# EAGLE board F2CE_V3_Main (EAGLE 9.6.2), part 1 of 2
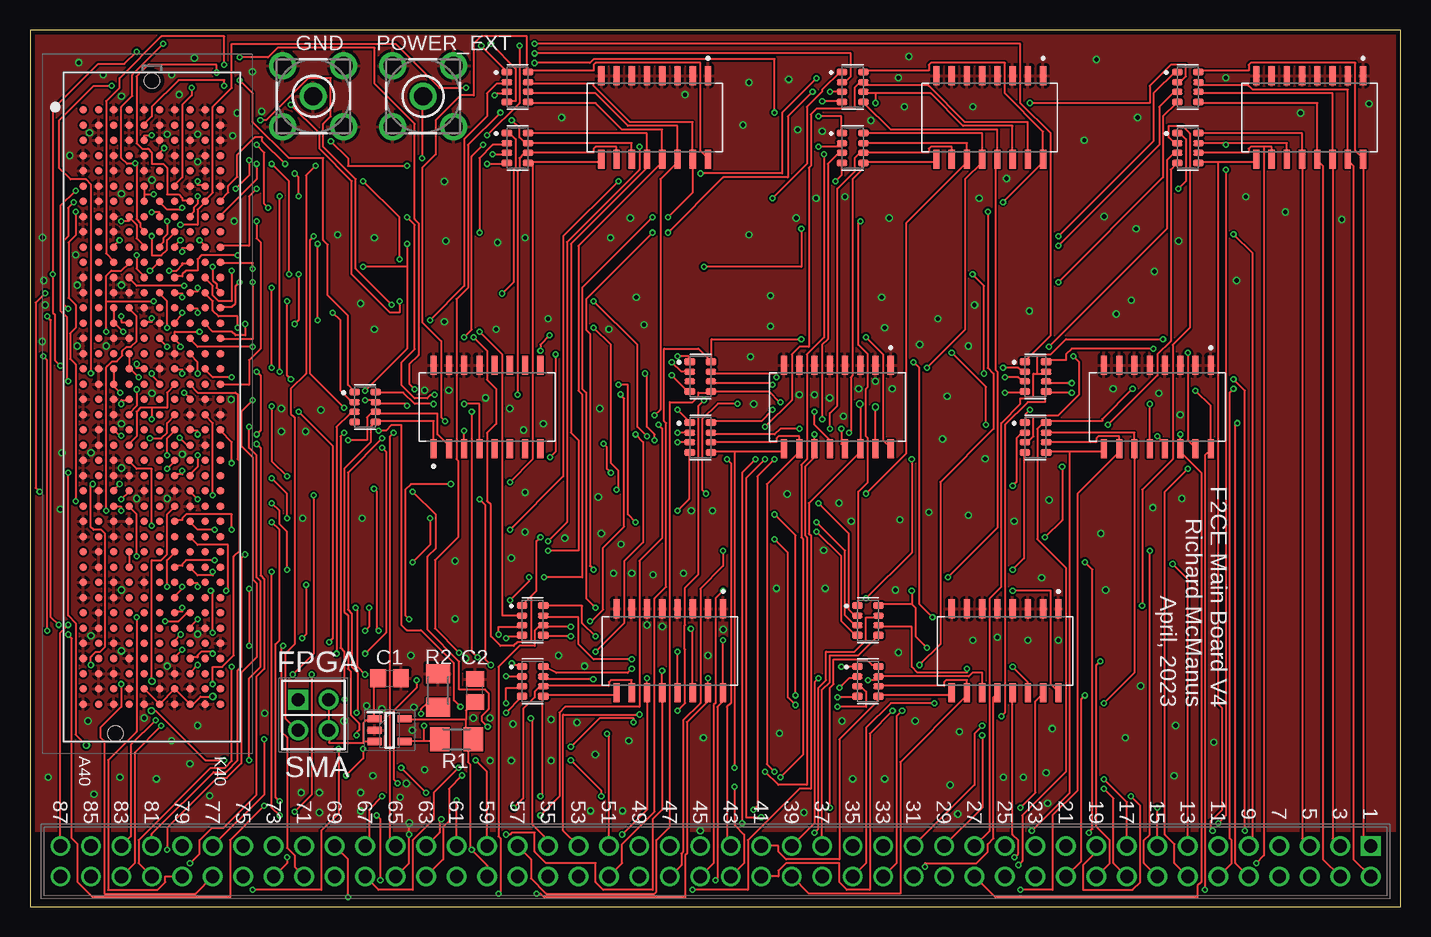
[diagram p4: board, top side]
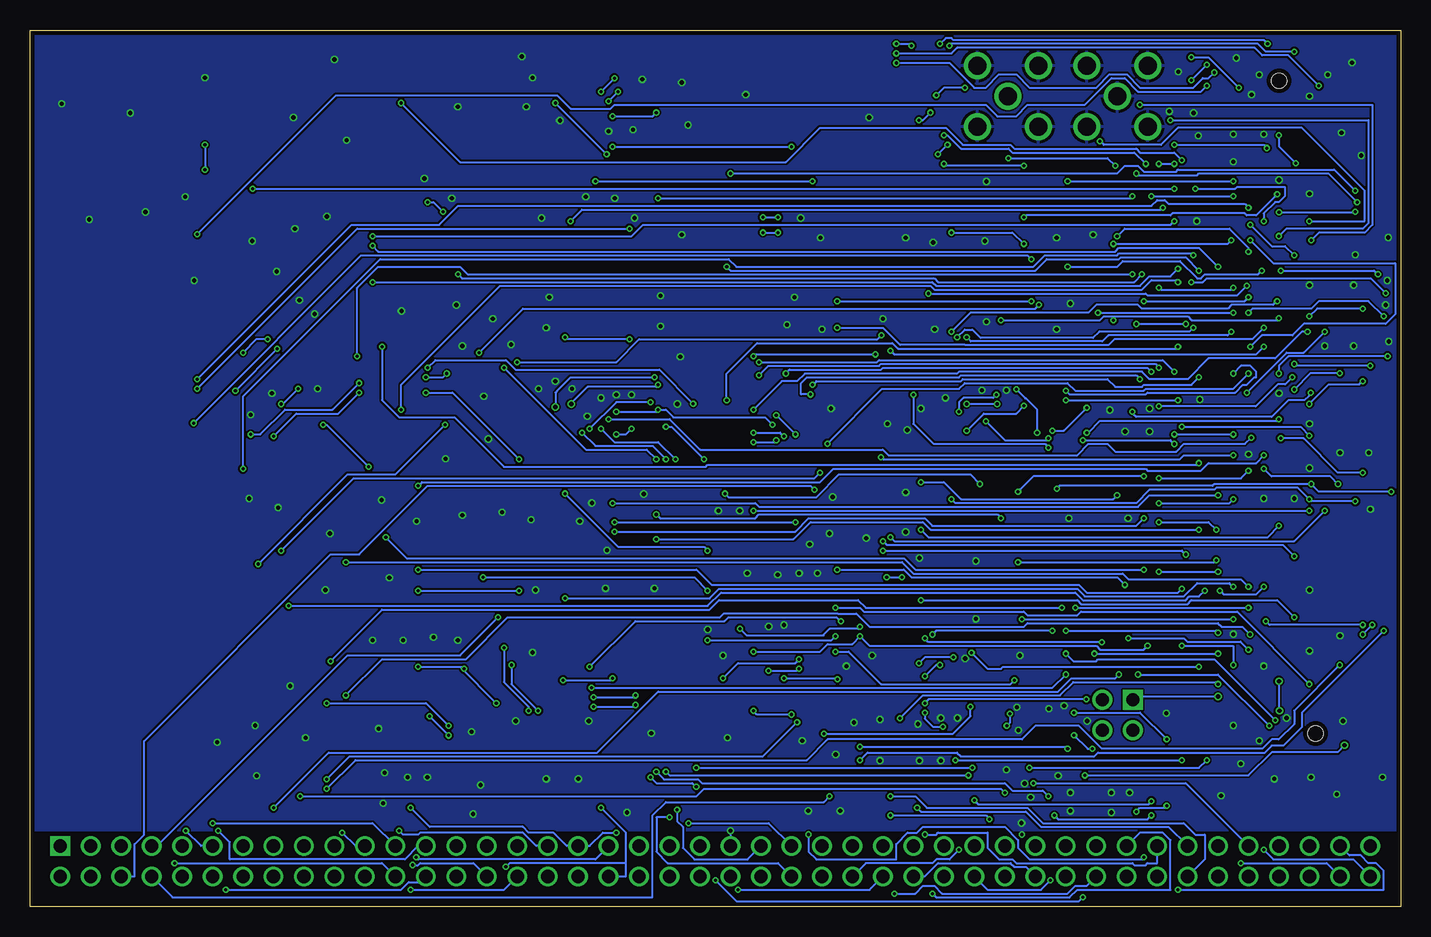
[diagram p5: board, bottom side, seen from below]

Size 114.28 x 73.08 mm. Coordinates in mm from the lower left corner, seen from the top.
Outline: 0,0 114.28,0 114.28,73.08 0,73.08 0,0
Copper layers (1*16): Top 0.035559375mm / dielectric 1.6mm / Bottom 0.035559375mm
Design rules "oshpark-2layer *": minimum track width 6mil, minimum drill 10mil, track to track 6mil, track to pad 6mil, pad to pad 8mil, via to via 6mil, smd to smd 6mil, copper to edge 15mil, drill to drill 6mil, minimum pad ring 5mil, minimum via ring 5mil, stop-mask expansion 2.5mil, vias tented up to drill 15mil, thermal gap 10mil

## Footprints (pad centres in the part's own frame; a part is rotated, then mirrored left to right if it is on the bottom)
RESCAXE80P320X160X70-8N = smd 0.9 x 0.61: 1 -0.885,1.24; 4 -0.885,-1.24; 5 0.885,-1.24; 8 0.885,1.24 | smd 0.9 x 0.53: 2 -0.885,0.4; 3 -0.885,-0.4; 6 0.885,-0.4; 7 0.885,0.4
SOIC127P762X240-16N = smd 1.59 x 0.6: 1 -3.495,4.445; 2 -3.495,3.175; 3 -3.495,1.905; 4 -3.495,0.635; 5 -3.495,-0.635; 6 -3.495,-1.905; 7 -3.495,-3.175; 8 -3.495,-4.445; 9 3.495,-4.445; 10 3.495,-3.175; 11 3.495,-1.905; 12 3.495,-0.635; 13 3.495,0.635; 14 3.495,1.905; 15 3.495,3.175; 16 3.495,4.445
C0805 = smd 1.3 x 1.5: 1 -0.95,0; 2 0.95,0
LTI-SASF54GT = drill 1.5 pad 2.2: 1 0,0; 2 -2.54,2.54; 3 2.54,2.54; 4 2.54,-2.54; 5 -2.54,-2.54
SOT95P280X100-5N = smd 1.15 x 0.6: 1 -1.25,0.95; 2 -1.25,0; 3 -1.25,-0.95; 4 1.25,-0.95; 5 1.25,0.95
88-PIN-HEADER = drill 1.1 pad 1.65 square: 1 0,109.22 | drill 1.1 pad 1.65: 2 2.54,109.22; 3 0,106.68; 4 2.54,106.68; 5 0,104.14; 6 2.54,104.14; 7 0,101.6; 8 2.54,101.6; 9 0,99.06; 10 2.54,99.06; 11 0,96.52; 12 2.54,96.52; 13 0,93.98; 14 2.54,93.98; 15 0,91.44; 16 2.54,91.44; 17 0,88.9; 18 2.54,88.9; 19 0,86.36; 20 2.54,86.36; 21 0,83.82; 22 2.54,83.82; 23 0,81.28; 24 2.54,81.28; 25 0,78.74; 26 2.54,78.74; 27 0,76.2; 28 2.54,76.2; 29 0,73.66; 30 2.54,73.66; 31 0,71.12; 32 2.54,71.12; 33 0,68.58; 34 2.54,68.58; 35 0,66.04; 36 2.54,66.04; 37 0,63.5; 38 2.54,63.5; 39 0,60.96; 40 2.54,60.96; 41 0,58.42; 42 2.54,58.42; 43 0,55.88; 44 2.54,55.88; 45 0,53.34; 46 2.54,53.34; 47 0,50.8; 48 2.54,50.8; 49 0,48.26; 50 2.54,48.26; 51 0,45.72; 52 2.54,45.72; 53 0,43.18; 54 2.54,43.18; 55 0,40.64; 56 2.54,40.64; 57 0,38.1; 58 2.54,38.1; 59 0,35.56; 60 2.54,35.56; 61 0,33.02; 62 2.54,33.02; 63 0,30.48; 64 2.54,30.48; 65 0,27.94; 66 2.54,27.94; 67 0,25.4; 68 2.54,25.4; 69 0,22.86; 70 2.54,22.86; 71 0,20.32; 72 2.54,20.32; 73 0,17.78; 74 2.54,17.78; 75 0,15.24; 76 2.54,15.24; 77 0,12.7; 78 2.54,12.7; 79 0,10.16; 80 2.54,10.16; 81 0,7.62; 82 2.54,7.62; 83 0,5.08; 84 2.54,5.08; 85 0,2.54; 86 2.54,2.54; 87 0,0; 88 2.54,0
ASP13460201 = smd 0.64 x 0.64: A1 24.765,5.715; A2 23.495,5.715; A3 22.225,5.715; A4 20.955,5.715; A5 19.685,5.715; A6 18.415,5.715; A7 17.145,5.715; A8 15.875,5.715; A9 14.605,5.715; A10 13.335,5.715; A11 12.065,5.715; A12 10.795,5.715; A13 9.525,5.715; A14 8.255,5.715; A15 6.985,5.715; A16 5.715,5.715; A17 4.445,5.715; A18 3.175,5.715; A19 1.905,5.715; A20 0.635,5.715; A21 -0.635,5.715; A22 -1.905,5.715; A23 -3.175,5.715; A24 -4.445,5.715; A25 -5.715,5.715; A26 -6.985,5.715; A27 -8.255,5.715; A28 -9.525,5.715; A29 -10.795,5.715; A30 -12.065,5.715; A31 -13.335,5.715; A32 -14.605,5.715; A33 -15.875,5.715; A34 -17.145,5.715; A35 -18.415,5.715; A36 -19.685,5.715; A37 -20.955,5.715; A38 -22.225,5.715; A39 -23.495,5.715; A40 -24.765,5.715; B1 24.765,4.445; B2 23.495,4.445; B3 22.225,4.445; B4 20.955,4.445; B5 19.685,4.445; B6 18.415,4.445; B7 17.145,4.445; B8 15.875,4.445; B9 14.605,4.445; B10 13.335,4.445; B11 12.065,4.445; B12 10.795,4.445; B13 9.525,4.445; B14 8.255,4.445; B15 6.985,4.445; B16 5.715,4.445; B17 4.445,4.445; B18 3.175,4.445; B19 1.905,4.445; B20 0.635,4.445; B21 -0.635,4.445; B22 -1.905,4.445; B23 -3.175,4.445; B24 -4.445,4.445; B25 -5.715,4.445; B26 -6.985,4.445; B27 -8.255,4.445; B28 -9.525,4.445; B29 -10.795,4.445; B30 -12.065,4.445; B31 -13.335,4.445; B32 -14.605,4.445; B33 -15.875,4.445; B34 -17.145,4.445; B35 -18.415,4.445; B36 -19.685,4.445; B37 -20.955,4.445; B38 -22.225,4.445; B39 -23.495,4.445; B40 -24.765,4.445; C1 24.765,3.175; C2 23.495,3.175; C3 22.225,3.175; C4 20.955,3.175; C5 19.685,3.175; C6 18.415,3.175; C7 17.145,3.175; C8 15.875,3.175; C9 14.605,3.175; C10 13.335,3.175; C11 12.065,3.175; C12 10.795,3.175; C13 9.525,3.175; C14 8.255,3.175; C15 6.985,3.175; C16 5.715,3.175; C17 4.445,3.175; C18 3.175,3.175; C19 1.905,3.175; C20 0.635,3.175; C21 -0.635,3.175; C22 -1.905,3.175; C23 -3.175,3.175; C24 -4.445,3.175; C25 -5.715,3.175; C26 -6.985,3.175; C27 -8.255,3.175; C28 -9.525,3.175; C29 -10.795,3.175; C30 -12.065,3.175; C31 -13.335,3.175; C32 -14.605,3.175; C33 -15.875,3.175; C34 -17.145,3.175; C35 -18.415,3.175; C36 -19.685,3.175; C37 -20.955,3.175; C38 -22.225,3.175; C39 -23.495,3.175; C40 -24.765,3.175; D1 24.765,1.905; D2 23.495,1.905; D3 22.225,1.905; D4 20.955,1.905; D5 19.685,1.905; D6 18.415,1.905; D7 17.145,1.905; D8 15.875,1.905; D9 14.605,1.905; D10 13.335,1.905; D11 12.065,1.905; D12 10.795,1.905; D13 9.525,1.905; D14 8.255,1.905; D15 6.985,1.905; D16 5.715,1.905; D17 4.445,1.905; D18 3.175,1.905; D19 1.905,1.905; D20 0.635,1.905; D21 -0.635,1.905; D22 -1.905,1.905; D23 -3.175,1.905; D24 -4.445,1.905; D25 -5.715,1.905; D26 -6.985,1.905; D27 -8.255,1.905; D28 -9.525,1.905; D29 -10.795,1.905; D30 -12.065,1.905; D31 -13.335,1.905; D32 -14.605,1.905; D33 -15.875,1.905; D34 -17.145,1.905; D35 -18.415,1.905; D36 -19.685,1.905; D37 -20.955,1.905; D38 -22.225,1.905; D39 -23.495,1.905; D40 -24.765,1.905; E1 24.765,0.635; E2 23.495,0.635; E3 22.225,0.635; E4 20.955,0.635; E5 19.685,0.635; E6 18.415,0.635; E7 17.145,0.635; E8 15.875,0.635; E9 14.605,0.635; E10 13.335,0.635; E11 12.065,0.635; E12 10.795,0.635; E13 9.525,0.635; E14 8.255,0.635; E15 6.985,0.635; E16 5.715,0.635; E17 4.445,0.635; E18 3.175,0.635; E19 1.905,0.635; E20 0.635,0.635; E21 -0.635,0.635; E22 -1.905,0.635; E23 -3.175,0.635; E24 -4.445,0.635; E25 -5.715,0.635; E26 -6.985,0.635; E27 -8.255,0.635; E28 -9.525,0.635; E29 -10.795,0.635; E30 -12.065,0.635; E31 -13.335,0.635; E32 -14.605,0.635; E33 -15.875,0.635; E34 -17.145,0.635; E35 -18.415,0.635; E36 -19.685,0.635; E37 -20.955,0.635; E38 -22.225,0.635; E39 -23.495,0.635; E40 -24.765,0.635; F1 24.765,-0.635; F2 23.495,-0.635; F3 22.225,-0.635; F4 20.955,-0.635; F5 19.685,-0.635; F6 18.415,-0.635; F7 17.145,-0.635; F8 15.875,-0.635; F9 14.605,-0.635; F10 13.335,-0.635; F11 12.065,-0.635; F12 10.795,-0.635; F13 9.525,-0.635; F14 8.255,-0.635; F15 6.985,-0.635; F16 5.715,-0.635; F17 4.445,-0.635; F18 3.175,-0.635; F19 1.905,-0.635; F20 0.635,-0.635; F21 -0.635,-0.635; F22 -1.905,-0.635; F23 -3.175,-0.635; F24 -4.445,-0.635; F25 -5.715,-0.635; F26 -6.985,-0.635; F27 -8.255,-0.635; F28 -9.525,-0.635; F29 -10.795,-0.635; F30 -12.065,-0.635; F31 -13.335,-0.635; F32 -14.605,-0.635; F33 -15.875,-0.635; F34 -17.145,-0.635; F35 -18.415,-0.635; F36 -19.685,-0.635; F37 -20.955,-0.635; F38 -22.225,-0.635; F39 -23.495,-0.635; F40 -24.765,-0.635; G1 24.765,-1.905; G2 23.495,-1.905; G3 22.225,-1.905; G4 20.955,-1.905; G5 19.685,-1.905; G6 18.415,-1.905; G7 17.145,-1.905; G8 15.875,-1.905; G9 14.605,-1.905; G10 13.335,-1.905; G11 12.065,-1.905; G12 10.795,-1.905; G13 9.525,-1.905; G14 8.255,-1.905; G15 6.985,-1.905; G16 5.715,-1.905; G17 4.445,-1.905; G18 3.175,-1.905; G19 1.905,-1.905; G20 0.635,-1.905; G21 -0.635,-1.905; G22 -1.905,-1.905; G23 -3.175,-1.905; G24 -4.445,-1.905; G25 -5.715,-1.905; G26 -6.985,-1.905; G27 -8.255,-1.905; G28 -9.525,-1.905; G29 -10.795,-1.905; G30 -12.065,-1.905; G31 -13.335,-1.905; G32 -14.605,-1.905; G33 -15.875,-1.905; G34 -17.145,-1.905; G35 -18.415,-1.905; G36 -19.685,-1.905; G37 -20.955,-1.905; G38 -22.225,-1.905; G39 -23.495,-1.905; G40 -24.765,-1.905; H1 24.765,-3.175; H2 23.495,-3.175; H3 22.225,-3.175; H4 20.955,-3.175; H5 19.685,-3.175; H6 18.415,-3.175; H7 17.145,-3.175; H8 15.875,-3.175; H9 14.605,-3.175; H10 13.335,-3.175; H11 12.065,-3.175; H12 10.795,-3.175; H13 9.525,-3.175; H14 8.255,-3.175; H15 6.985,-3.175; H16 5.715,-3.175; H17 4.445,-3.175; H18 3.175,-3.175; H19 1.905,-3.175; H20 0.635,-3.175; H21 -0.635,-3.175; H22 -1.905,-3.175; H23 -3.175,-3.175; H24 -4.445,-3.175; H25 -5.715,-3.175; H26 -6.985,-3.175; H27 -8.255,-3.175; H28 -9.525,-3.175; H29 -10.795,-3.175; H30 -12.065,-3.175; H31 -13.335,-3.175; H32 -14.605,-3.175; H33 -15.875,-3.175; H34 -17.145,-3.175; H35 -18.415,-3.175; H36 -19.685,-3.175; H37 -20.955,-3.175; H38 -22.225,-3.175; H39 -23.495,-3.175; H40 -24.765,-3.175; J1 24.765,-4.445; J2 23.495,-4.445; J3 22.225,-4.445; J4 20.955,-4.445; J5 19.685,-4.445; J6 18.415,-4.445; J7 17.145,-4.445; J8 15.875,-4.445; J9 14.605,-4.445; J10 13.335,-4.445; J11 12.065,-4.445; J12 10.795,-4.445; J13 9.525,-4.445; J14 8.255,-4.445; J15 6.985,-4.445; J16 5.715,-4.445; J17 4.445,-4.445; J18 3.175,-4.445; J19 1.905,-4.445; J20 0.635,-4.445; J21 -0.635,-4.445; J22 -1.905,-4.445; J23 -3.175,-4.445; J24 -4.445,-4.445; J25 -5.715,-4.445; J26 -6.985,-4.445; J27 -8.255,-4.445; J28 -9.525,-4.445; J29 -10.795,-4.445; J30 -12.065,-4.445; J31 -13.335,-4.445; J32 -14.605,-4.445; J33 -15.875,-4.445; J34 -17.145,-4.445; J35 -18.415,-4.445; J36 -19.685,-4.445; J37 -20.955,-4.445; J38 -22.225,-4.445; J39 -23.495,-4.445; J40 -24.765,-4.445; K1 24.765,-5.715; K2 23.495,-5.715; K3 22.225,-5.715; K4 20.955,-5.715; K5 19.685,-5.715; K6 18.415,-5.715; K7 17.145,-5.715; K8 15.875,-5.715; K9 14.605,-5.715; K10 13.335,-5.715; K11 12.065,-5.715; K12 10.795,-5.715; K13 9.525,-5.715; K14 8.255,-5.715; K15 6.985,-5.715; K16 5.715,-5.715; K17 4.445,-5.715; K18 3.175,-5.715; K19 1.905,-5.715; K20 0.635,-5.715; K21 -0.635,-5.715; K22 -1.905,-5.715; K23 -3.175,-5.715; K24 -4.445,-5.715; K25 -5.715,-5.715; K26 -6.985,-5.715; K27 -8.255,-5.715; K28 -9.525,-5.715; K29 -10.795,-5.715; K30 -12.065,-5.715; K31 -13.335,-5.715; K32 -14.605,-5.715; K33 -15.875,-5.715; K34 -17.145,-5.715; K35 -18.415,-5.715; K36 -19.685,-5.715; K37 -20.955,-5.715; K38 -22.225,-5.715; K39 -23.495,-5.715; K40 -24.765,-5.715 | hole 1.27: -27.19,3.046; 27.19,0
HDRV4W64P254_2X2_521X508X851P = drill 1.1 pad 1.65 square: 1 0,0 | drill 1.1 pad 1.65: 2 0,2.54; 3 2.54,0; 4 2.54,2.54
M1206 = smd 1.6 x 2: 1 -1.4,0; 2 1.4,0

## Placement (x,y rotation side)
4BITVD1:R1  YC164-FR-0760R4L  [RESCAXE80P320X160X70-8N]  27.94,41.66 0 top
4BITVD1:RN1  4816P-1-121LF  [SOIC127P762X240-16N]  38.1,41.66 90 top
8BITVD1:R1  YC164-FR-0760R4L  [RESCAXE80P320X160X70-8N]  96.52,68.33 0 top
8BITVD1:R2  YC164-FR-0760R4L  [RESCAXE80P320X160X70-8N]  96.52,63.25 0 top
8BITVD1:RN1  4816P-1-121LF  [SOIC127P762X240-16N]  106.68,65.79 270 top
8BITVD2:R1  YC164-FR-0760R4L  [RESCAXE80P320X160X70-8N]  83.82,44.2 0 top
8BITVD2:R2  YC164-FR-0760R4L  [RESCAXE80P320X160X70-8N]  83.82,39.12 0 top
8BITVD2:RN1  4816P-1-121LF  [SOIC127P762X240-16N]  93.98,41.66 270 top
8BITVD3:R1  YC164-FR-0760R4L  [RESCAXE80P320X160X70-8N]  69.85,23.88 0 top
8BITVD3:R2  YC164-FR-0760R4L  [RESCAXE80P320X160X70-8N]  69.85,18.8 0 top
8BITVD3:RN1  4816P-1-121LF  [SOIC127P762X240-16N]  81.28,21.34 270 top
8BITVD4:R1  YC164-FR-0760R4L  [RESCAXE80P320X160X70-8N]  68.58,68.33 0 top
8BITVD4:R2  YC164-FR-0760R4L  [RESCAXE80P320X160X70-8N]  68.58,63.25 0 top
8BITVD4:RN1  4816P-1-121LF  [SOIC127P762X240-16N]  80.01,65.79 270 top
8BITVD5:R1  YC164-FR-0760R4L  [RESCAXE80P320X160X70-8N]  55.88,44.2 0 top
8BITVD5:R2  YC164-FR-0760R4L  [RESCAXE80P320X160X70-8N]  55.88,39.12 0 top
8BITVD5:RN1  4816P-1-121LF  [SOIC127P762X240-16N]  67.31,41.66 270 top
8BITVD6:R1  YC164-FR-0760R4L  [RESCAXE80P320X160X70-8N]  41.91,23.88 0 top
8BITVD6:R2  YC164-FR-0760R4L  [RESCAXE80P320X160X70-8N]  41.91,18.8 0 top
8BITVD6:RN1  4816P-1-121LF  [SOIC127P762X240-16N]  53.34,21.34 270 top
8BITVD7:R1  YC164-FR-0760R4L  [RESCAXE80P320X160X70-8N]  40.64,68.33 0 top
8BITVD7:R2  YC164-FR-0760R4L  [RESCAXE80P320X160X70-8N]  40.64,63.25 0 top
8BITVD7:RN1  4816P-1-121LF  [SOIC127P762X240-16N]  52.07,65.79 270 top
C1  1 uF  [C0805]  29.97,19.05 0 top
C2  1 uF  [C0805]  37.08,18.03 90 top
GND  LTI-SASF54GT  [LTI-SASF54GT]  23.62,67.56 0 top
IC1  ADP171AUJZ-R7  [SOT95P280X100-5N]  29.97,14.73 0 top
J1  88-PIN-HEADER  [88-PIN-HEADER]  2.54,5.08 270 top
J2  ASP-134602-01  [ASP13460201]  10.16,41.66 90 top
J3  70287-1098  [HDRV4W64P254_2X2_521X508X851P]  22.35,17.27 270 top
POWER_EXT  LTI-SASF54GT  [LTI-SASF54GT]  32.77,67.56 0 top
R1  510  [M1206]  35.56,13.97 180 top
R2  360  [M1206]  34.04,18.03 270 top

## Tracks (layer width: path | path; a pad name or v marks a point on that pad's centre or on a via)
4BITVD1:OUT3  (via drill 0.25)
  Top 0.152: v33.66,41.91 32.07,41.91 31.11,42.86 28.89,42.86 4BITVD1:R1.8 | v36.2,41.91 37.47,41.91 4BITVD1:RN1.4
  Bottom 0.152: v36.2,41.91 v33.66,41.91
8BITVD5:OUT1  (via drill 0.25, 0.35)
  Top 0.152: v62.23,44.13 62.23,44.45 56.83,44.45 8BITVD5:R1.7 | 8BITVD5:RN1.15 v70.48,41.66
  Bottom 0.152: v62.23,44.13 69.22,44.13 70.33,43.02 70.48,42.86 v70.48,41.66
C10  (via drill 0.25)
  Top 0.152: v7.46,55.56 6.99,55.09 J2.C10 | v21.75,66.83 24.13,64.45 24.13,63.18 26.83,60.48 26.83,52.7 30,49.53 30.8,49.53 v30.8,50.48 | v46.99,50.48 50.64,46.83 50.64,40.01 v51.44,39.21 | v53.98,39.53 54.93,39.53 8BITVD5:R2.2
  Bottom 0.152: v7.46,55.56 6.83,56.2 3.02,56.2 2.38,56.83 2.38,66.83 2.77,66.83 v21.75,66.83 | v46.99,50.48 v30.8,50.48 | v51.44,39.21 51.75,39.53 v53.98,39.53
C11  (via drill 0.25)
  Top 0.152: v16.19,70.17 16.19,72.55 10.95,72.55 7.46,69.06 7.46,68.26 6.35,67.15 6.35,54.45 6.99,53.82 J2.C11 | v17.46,68.9 18.57,67.79 18.57,65.41 21.59,62.39 24.45,62.39 24.45,55.56 24.83,55.18 24.83,50.96 26.51,49.28 26.51,43.5 26.99,43.02 4BITVD1:R1.1
  Bottom 0.152: v17.46,68.9 v16.19,70.17
C14&C15  (via drill 0.25)
  Top 0.152: J2.C14 6.99,48.74 | v53.98,41.43 54.93,40.48 8BITVD5:R2.1 | 6.99,48.74 v7.78,47.94 | 6.99,48.74 J2.C15
  Bottom 0.152: v53.98,41.43 51.59,43.81 50.32,43.81 49.69,44.45 36.99,44.45 36.83,44.61 21.59,44.61 20.95,43.97 17.78,43.97 16.03,45.72 10.48,45.72 8.26,47.94 v7.78,47.94
C18&C19  (via drill 0.25)
  Top 0.152: J2.C18 J2.C19 6.99,43.4 v7.53,42.86 | v39.69,22.38 39.69,22.54 40.96,22.54 8BITVD6:R1.4 | v24.92,22.07 25.24,22.38 25.24,38.42 v22.38,41.27
  Bottom 0.152: v39.69,22.38 39.37,22.07 v24.92,22.07 | v22.38,41.27 22.38,41.15 22.07,40.83 10.76,40.83 9.37,42.23 8.03,42.23 7.65,42.61 7.65,42.74 v7.53,42.86
C22  (via drill 0.25)
  Top 0.152: J2.C22 7.4,39.34 7.62,39.34 v7.62,39.27 | v18.26,40.01 18.26,38.26 18.89,37.62 18.89,27.46 19.21,27.15 19.21,20 18.26,19.05 v18.26,12.22 | v37.15,12.22 38.1,11.27 J1.59
  Bottom 0.152: v7.62,39.27 8.35,40.01 v18.26,40.01 | v37.15,12.22 v18.26,12.22
C26&K14  (via drill 0.25)
  Top 0.152: v7.46,35.24 6.99,34.77 J2.C26 | v0.79,34.61 0.48,34.92 0.48,50.35 v1.27,51.15 | v17.46,52.07 17.14,51.75 17.14,50.32 16.83,50.01 15.88,50.01 J2.K14 | v39.05,22.7 39.05,23.34 40.96,23.34 8BITVD6:R1.3 | v29.05,23.02 28.89,23.18 28.89,34.64 v28.67,34.86
  Bottom 0.152: v0.79,34.61 6.83,34.61 v7.46,35.24 15.56,35.24 15.72,35.08 28.45,35.08 v28.67,34.86 | v1.27,51.15 2.51,52.39 16.19,52.39 16.51,52.07 v17.46,52.07 | v39.05,22.7 38.73,23.02 v29.05,23.02
C27  (via drill 0.25)
  Top 0.152: v7.62,33.02 7.62,33.34 6.99,33.34 J2.C27 | v53.98,33.02 54.93,33.97 54.93,37.78 8BITVD5:R2.4
  Bottom 0.152: v53.98,33.02 v7.62,33.02
CS10  (via drill 0.25)
  Top 0.152: 8BITVD5:R2.6 56.83,38.73 62.23,38.73 62.23,39.05 62.39,39.21 64.14,39.21 8BITVD5:RN1.10 64.14,37.94 61.44,35.24 61.44,11.91 v62.07,11.27 | J1.67 28.26,5.4 28.26,8.1 v29.37,9.21
  Bottom 0.152: v29.37,9.21 29.84,9.68 32.38,9.68 33.02,10.32 58.26,10.32 58.58,10.64 61.44,10.64 v62.07,11.27
CS11  (via drill 0.25)
  Top 0.152: 4BITVD1:RN1.1 33.66,40.48 28.89,40.48 4BITVD1:R1.5 28.73,40.32 28.42,40.01 28.42,38.73 26.19,36.51 26.19,24.61 26.51,24.29 26.51,19.84 26.73,19.62 26.73,16 27.43,15.3 27.43,14.73 27.24,14.54 v27.24,14.32 | v18.57,1.43 24.29,1.43 24.29,6.35 25.72,7.78 v25.72,13.18
  Bottom 0.152: J1.85 4.29,4.29 3.33,4.29 2.7,3.65 2.06,3.65 1.43,3.02 1.43,1.43 v18.57,1.43 | v27.24,14.32 26.1,13.18 v25.72,13.18
CS14&CS15  (via drill 0.25)
  Top 0.152: 58.74,37.94 62.87,37.94 8BITVD5:RN1.9 | 58.74,37.94 56.83,37.94 8BITVD5:R2.5 | J1.68 29.05,1.43 31.91,1.43 31.91,5.56 33.66,7.3 33.66,9.53 v35.72,11.59 | 58.74,37.94 v58.74,11.59
  Bottom 0.152: v58.74,11.59 v35.72,11.59
CS18&CS19  (via drill 0.25)
  Top 0.152: v47.15,22.54 46.04,23.65 46.04,25.08 42.86,25.08 8BITVD6:R1.8 | v57.78,22.23 8BITVD6:RN1.16 57.78,17.14 57.31,16.67 57.31,2.38 v57.15,2.22 | J1.69 26.51,3.97 v26.51,0.79
  Bottom 0.152: v47.15,22.54 47.47,22.23 v57.78,22.23 | v26.51,0.79 26.83,0.48 55.4,0.48 v57.15,2.22
CS26&KS14  (via drill 0.25)
  Top 0.152: v50.16,20.64 46.99,20.64 45.72,21.91 45.72,24.13 42.86,24.13 8BITVD6:R1.7 | v56.52,19.05 8BITVD6:RN1.15 56.52,17.14 54.77,15.4 54.77,4.45 54.61,4.29 54.61,0.79 42.86,0.79 42.55,1.11 v42.23,1.11
  Bottom 0.152: v50.16,20.64 50.48,20.32 55.24,20.32 v56.52,19.05 | J1.70 26.19,1.75 27.15,1.75 27.78,1.11 38.26,1.11 38.89,1.75 39.85,1.75 40.48,1.11 v42.23,1.11
CS27  (via drill 0.25)
  Top 0.152: v61.91,41.43 60.96,40.48 56.83,40.48 8BITVD5:R2.8 | v65.41,41.27 65.41,40.16 66.67,38.89 8BITVD5:RN1.12 | J1.63 34.13,6.19 34.13,7.14 v34.29,7.3 | v42.55,7.62 44.13,9.21 44.13,16.19 44.61,16.67 50.8,16.67 50.8,28.83 52.7,30.73 52.7,39.85 v52.39,40.16
  Bottom 0.152: v65.41,41.27 62.07,41.27 v61.91,41.43 61.28,41.43 60.64,40.8 53.02,40.8 v52.39,40.16 | v34.29,7.3 34.61,7.62 v42.55,7.62
D8&E10  (via drill 0.25)
  Top 0.152: 8.26,57.47 8.89,56.83 8.89,55.72 9.53,55.09 J2.E10 | v38.1,61.91 39.69,61.91 8BITVD7:R2.4 | v31.43,61.75 26.51,61.75 26.51,62.39 v25.08,63.82 | v7.62,57.15 8.26,57.15 8.26,57.47 | 8.26,57.47 J2.D8
  Bottom 0.152: v38.1,61.91 37.94,61.75 v31.43,61.75 | v25.08,63.82 24.77,63.5 20,63.5 18.57,64.93 8.26,64.93 3.02,59.69 3.02,57.15 v7.62,57.15
D11&H20  (via drill 0.25)
  Top 0.152: v6.35,47.94 6.35,50.48 | v12.86,42.86 13.34,42.39 J2.H20 | J2.D11 8.26,53.66 7.62,53.02 6.78,53.02 6.35,52.59 6.35,50.48 | v37.47,47.94 39.37,46.04 39.37,24.29 40.96,24.29 8BITVD6:R1.2 | 6.35,50.48 v10.32,50.48
  Bottom 0.152: v6.35,47.94 8.1,46.2 9.53,46.2 v12.86,42.86 | v37.47,47.94 35.88,49.53 26.04,49.53 25.4,50.16 21.91,50.16 21.59,49.85 14.45,49.85 14.13,50.16 10.64,50.16 v10.32,50.48
D12  (via drill 0.25)
  Top 0.152: v12.86,51.75 8.89,51.75 8.26,52.39 J2.D12 | v39.37,51.12 40.32,52.07 40.32,61.44 40.48,61.59 40.48,63.98 39.85,64.61 8BITVD7:R2.1
  Bottom 0.152: v12.86,51.75 13.65,50.96 21.11,50.96 21.27,51.12 v39.37,51.12
D14&J13  (via drill 0.25)
  Top 0.152: v6.35,33.02 6.35,44.96 6.44,45.04 6.44,45.06 6.84,45.47 7.24,45.47 7.71,45.93 7.71,46.33 8.05,46.67 8.41,46.67 8.89,47.15 8.89,49.21 8.26,49.85 J2.D14 | v42.55,30.8 42.23,30.48 42.23,26.35 41.75,25.88 | 41.75,25.88 41.12,25.24 8BITVD6:R1.1 | v17.3,48.26 17.3,49.21 15.72,49.21 15.24,49.69 15.24,50.48 14.61,51.12 J2.J13 | v36.99,47.47 38.1,46.35 38.1,43.94 38.86,43.18 38.86,40.26 38.1,39.5 38.1,33.81 38.42,33.5 38.42,22.54 39.21,21.75 40.32,21.75 40.64,22.07 41.75,22.07 41.75,25.88
  Bottom 0.152: v6.35,33.02 8.89,30.48 42.23,30.48 v42.55,30.8 | v17.3,48.26 17.62,47.94 25.15,47.94 25.66,47.43 35.05,47.43 35.72,48.1 36.35,48.1 v36.99,47.47
D15  (via drill 0.25)
  Top 0.152: v7.62,49.21 7.62,48.74 8.26,48.74 J2.D15 | v3.65,58.74 3.17,58.26 3.17,55.88 2.85,55.55 2.85,50.18 v3.17,49.85 | v22.07,61.12 22.38,60.8 v22.38,59.21 | v61.91,59.05 64.77,61.91 64.77,66.67 66.04,67.94 66.04,68.1 67.63,69.69 8BITVD4:R1.1
  Bottom 0.152: v7.62,49.21 6.99,49.85 v3.17,49.85 | v3.65,58.74 6.03,61.12 16.83,61.12 16.99,60.96 21.91,60.96 v22.07,61.12 | v22.38,59.21 22.54,59.05 v61.91,59.05
D17&D18  (via drill 0.25)
  Top 0.152: J2.D17 8.26,44.93 | v39.69,16.19 40.96,17.46 8BITVD6:R2.4 | v38.16,15.02 37.66,15.53 37.66,15.91 38.23,16.48 38.23,17.81 37.94,18.1 35.78,18.1 35.78,20.45 33.15,23.08 33.15,29.21 33.85,29.91 33.85,32.67 v31.91,34.61 | v21.43,35.88 20.16,37.15 v20.16,41.72 | 8.26,44.93 v9.05,44.13 | 8.26,44.93 J2.D18
  Bottom 0.152: v39.69,16.19 39.69,15.68 39.02,15.02 v38.16,15.02 | v31.91,34.61 30.64,35.88 v21.43,35.88 | v20.16,41.72 12.1,41.72 10.27,43.55 9.64,43.55 v9.05,44.13
D20  (via drill 0.25)
  Top 0.152: v7.62,41.91 7.62,42.23 8.26,42.23 J2.D20 | v3.17,43.81 3.05,43.94 3.05,49.18 2.54,49.69 2.54,58.42 v3.81,59.69 | v55.88,61.12 62.71,61.12 62.71,66.2 v65.56,69.06 | v66.67,67.94 67.63,67.94 8BITVD4:R1.3
  Bottom 0.152: v7.62,41.91 5.99,43.54 3.45,43.54 v3.17,43.81 | v3.81,59.69 5.56,61.44 18.57,61.44 18.73,61.28 21.43,61.28 21.91,61.75 23.02,61.75 23.65,61.12 v55.88,61.12 | v66.67,67.94 v65.56,69.06
D21  (via drill 0.25)
  Top 0.152: v8.89,43.12 8.89,41.75 8.26,41.12 J2.D21 | v42.07,71.12 68.42,71.12 68.42,69.22 67.79,68.58 8BITVD4:R1.2 | v6.83,68.42 5.3,68.42 2.41,65.53 2.41,61.59 3.39,60.62 4.67,60.62 5.08,60.21 v5.08,44.48
  Bottom 0.152: v8.89,43.12 7.53,44.48 v5.08,44.48 | v6.83,68.42 9.37,70.96 11.56,70.96 12.19,71.6 36.99,71.6 37.47,71.12 v42.07,71.12
D23&G19  (via drill 0.25)
  Top 0.152: 10.16,41.59 11.43,41.59 11.43,42.86 12.06,43.5 J2.G19 | 10.16,41.59 9.21,41.59 8.89,41.27 8.89,39.21 8.26,38.58 J2.D23 | v39.69,16.99 39.69,18.26 40.96,18.26 8BITVD6:R2.3 | v26.23,17.3 26.19,17.34 26.19,21.27 25.88,21.59 25.88,39.21 v26.19,39.53 | 10.16,41.59 v10.16,40.64
  Bottom 0.152: v39.69,16.99 39.37,17.3 v26.23,17.3 | v26.19,39.53 26.07,39.53 25.08,40.51 10.29,40.51 v10.16,40.64
D24  (via drill 0.25)
  Top 0.152: v10.16,31.75 10.16,36.51 8.89,36.51 8.26,37.15 J2.D24 | v40.01,31.43 44.45,35.88 44.45,55.88 v49.05,60.48 | v67.15,60.48 67.63,60.96 67.63,61.91 8BITVD4:R2.4
  Bottom 0.152: v10.16,31.75 11.11,30.8 39.37,30.8 v40.01,31.43 | v67.15,60.48 v49.05,60.48
D26&F8  (via drill 0.25)
  Top 0.152: v7.62,33.97 8.26,34.61 J2.D26 | v3.81,57.94 3.81,55.96 3.23,55.37 3.23,50.75 3.81,50.16 3.81,48.26 3.35,47.8 3.35,45.67 3.81,45.21 v3.81,33.81 | v10.15,57.9 10.79,57.9 J2.F8 | v39.69,19.21 40.96,19.21 8BITVD6:R2.2 | v38.42,20.16 37.94,20.64 37.94,33.5 v37.47,33.97
  Bottom 0.152: v3.81,33.81 7.46,33.81 v7.62,33.97 8.57,34.92 15.4,34.92 15.56,34.77 20.95,34.77 22.07,33.66 37.15,33.66 v37.47,33.97 | v3.81,57.94 3.85,57.9 v10.15,57.9 | v39.69,19.21 38.73,20.16 v38.42,20.16
D27  (via drill 0.25)
  Top 0.152: v8.89,29.21 8.89,32.7 8.26,33.34 J2.D27 | v43.18,30.48 44.77,32.07 44.77,55.4 50.8,61.44 v50.8,63.34 | v65.72,63.34 67.63,63.34 67.63,63.5 8BITVD4:R2.2
  Bottom 0.152: v8.89,29.21 9.84,30.16 42.86,30.16 v43.18,30.48 | v65.72,63.34 v50.8,63.34
DS8&ES10  (via drill 0.25)
  Top 0.152: 8BITVD7:R2.8 41.59,64.45 51.44,64.45 8BITVD7:RN1.12 51.44,61.59 45.09,55.24 45.09,39.53 45.72,38.89 45.72,29.69 v43.18,29.69 | v17.94,29.37 17.62,29.05 17.62,20 17.3,19.68 17.3,12.21 16.38,11.28 16.36,11.28 16.32,11.24 15.3,11.24 10.16,6.1 J1.81
  Bottom 0.152: v17.94,29.37 18.26,29.69 v43.18,29.69
DS11&HS20  (via drill 0.25)
  Top 0.152: v45.09,23.34 42.86,23.34 8BITVD6:R1.6 42.7,23.34 42.39,23.34 42.07,23.02 42.07,21.75 40.8,21.75 39.05,20 39.05,5.87 39.21,5.71 39.21,1.27 v39.05,1.11 | v55.09,23.18 55.24,23.02 8BITVD6:RN1.14
  Bottom 0.152: v45.09,23.34 45.24,23.18 47.62,23.18 48.13,22.67 48.13,22.61 54.52,22.61 v55.09,23.18 | J1.71 21.75,6.19 19.84,6.19 19.21,5.56 19.21,1.43 26.99,1.43 27.62,0.79 38.73,0.79 v39.05,1.11
DS12  (via drill 0.25)
  Top 0.152: 41.91,62.07 47.62,62.07 8BITVD7:RN1.9 | 41.91,62.07 41.59,62.07 8BITVD7:R2.5 41.91,62.07 | J1.84 8.73,3.65 8.73,12.86 v10.95,15.08 | v21.91,19.37 23.65,21.11 v23.65,34.29 | v40.01,35.4 41.91,37.31 41.91,62.07
  Bottom 0.152: v10.95,15.08 15.24,19.37 v21.91,19.37 | v23.65,34.29 23.97,33.97 36.67,33.97 38.1,35.4 v40.01,35.4
DS14&JS13  (via drill 0.25)
  Top 0.152: v45.09,22.54 42.86,22.54 8BITVD6:R1.5 | 8BITVD6:RN1.13 v53.98,21.27 | J1.72 22.07,3.33 22.07,4.29 21.43,4.92 21.43,14.13 20.95,14.61 20.95,21.59 v21.11,21.75
  Bottom 0.152: v53.98,21.27 48.42,21.27 47.78,21.91 45.72,21.91 v45.09,22.54 44.29,21.75 25.4,21.75 25.08,21.43 21.43,21.43 v21.11,21.75
DS15  (via drill 0.25)
  Top 0.152: 8BITVD4:R1.5 69.53,66.99 71.75,64.77 80.64,64.77 8BITVD4:RN1.13 80.64,62.23 80.49,62.07 80.49,44.77 80.64,44.61 80.64,31.59 v76.52,27.46 | J1.46 56.99,3.65 56.99,16.83 57.15,16.99 57.15,25.72 v57.78,26.35
  Bottom 0.152: v57.78,26.35 58.9,27.46 v76.52,27.46
DS17&DS18  (via drill 0.25)
  Top 0.152: v50.16,19.84 49.82,19.49 43.89,19.49 8BITVD6:R2.8 | v52.7,19.68 8BITVD6:RN1.12 52.7,8.1 51.91,7.3 51.91,1.43 47.78,1.43 47.15,2.06 47.15,3.65 43.02,3.65 42.07,4.6 42.07,6.19 40.16,6.19 40.01,6.03 v39.69,6.03
  Bottom 0.152: v50.16,19.84 50.32,19.68 v52.7,19.68 | J1.73 20.32,3.65 21.11,3.65 21.27,3.49 22.23,3.49 22.38,3.65 32.07,3.65 32.38,3.97 33.5,3.97 34.45,4.92 34.45,6.19 38.58,6.19 38.73,6.03 v39.69,6.03
DS20  (via drill 0.25)
  Top 0.152: 8BITVD4:RN1.15 83.19,65.41 77.95,65.41 74.93,68.42 74.93,68.45 69.59,68.45 8BITVD4:R1.7 69.37,68.58 69.06,68.58 68.74,68.26 68.74,66.52 65.56,66.52 65.09,66.04 65.09,61.75 64.93,61.59 64.93,46.67 64.14,46.67 63.5,46.04 63.5,42.23 v61.28,40.01 | J1.43 58.1,5.4 58.1,16.67 58.42,16.99 58.42,36.99 v58.1,37.31
  Bottom 0.152: v58.1,37.31 60.8,40.01 v61.28,40.01
DS21  (via drill 0.25)
  Top 0.152: 70.48,67.79 75.09,67.79 77.79,65.09 81.92,65.09 8BITVD4:RN1.14 | 70.48,67.79 69.53,67.79 8BITVD4:R1.6 | J1.44 59.53,3.65 59.53,6.03 58.74,6.83 v58.74,10 | v62.55,10.79 64.45,12.7 64.45,30.64 64.29,30.8 64.29,36.83 64.77,37.31 64.77,46.04 66.2,47.47 v66.2,62.71 | 70.48,67.79 v70.48,66.99
  Bottom 0.152: v58.74,10 59.05,10.32 62.07,10.32 v62.55,10.79 | v70.48,66.99 v66.2,62.71
DS23&GS19  (via drill 0.25)
  Top 0.152: 8BITVD6:R2.7 43.04,18.95 46.93,18.95 v46.96,18.99 | v51.44,19.05 8BITVD6:RN1.11 51.44,8.1 v49.37,6.03 | J1.74 21.43,3.65 v21.43,4.13
  Bottom 0.152: v46.96,18.99 47.02,19.05 v51.44,19.05 | v21.43,4.13 21.59,3.97 30.96,3.97 31.91,4.92 31.91,5.56 33.02,6.67 39.85,6.67 40.32,6.19 41.12,6.19 42.07,5.24 42.07,3.97 48.74,3.97 49.37,4.6 v49.37,6.03
DS24  (via drill 0.25)
  Top 0.152: 8BITVD4:R2.8 69.53,64.45 79.38,64.45 8BITVD4:RN1.12 79.38,62.07 77.95,60.64 77.95,48.1 v74.77,44.93 | v60.33,8.1 60.64,8.41 60.64,35.88 v62.07,37.31
  Bottom 0.152: J1.47 54.45,3.97 58.9,3.97 59.85,4.92 59.85,6.67 60.33,7.14 v60.33,8.1 | v62.07,37.31 62.87,38.1 67.94,38.1 v74.77,44.93
DS26&FS8  (via drill 0.25)
  Top 0.152: 8BITVD6:RN1.10 50.16,18.89 48.42,18.89 48.26,18.73 48.26,18.41 42.86,18.41 8BITVD6:R2.6 42.7,18.26 42.39,18.26 42.07,17.94 42.07,17.46 41.12,16.51 41.12,9.05 v40.32,8.26
  Bottom 0.152: J1.75 19.37,6.67 30,6.67 31.27,7.94 40.01,7.94 v40.32,8.26
DS27  (via drill 0.25)
  Top 0.152: 8BITVD4:RN1.10 76.83,63.34 75.09,63.34 74.93,63.18 74.93,62.87 69.53,62.87 8BITVD4:R2.6 69.37,62.71 69.06,62.71 68.74,62.39 68.74,61.28 67.31,59.85 67.31,41.78 66.67,41.15 v66.67,39.85 | v59.37,6.99 59.37,36.2 v60.48,37.31
  Bottom 0.152: J1.49 52.7,6.99 v59.37,6.99 | v60.48,37.31 61.91,38.73 65.56,38.73 v66.67,39.85
E2  (via drill 0.25)
  Top 0.152: v16.19,68.42 16.19,68.9 12.38,68.9 10.16,66.67 10.16,65.88 9.53,65.25 J2.E2 | v100.33,56.04 101.92,54.45 101.92,5.4 J1.9
  Bottom 0.152: v16.19,68.42 16.67,67.94 21.91,67.94 23.02,69.06 24.13,69.06 26.35,66.83 31.11,66.83 32.07,65.88 33.66,65.88 34.61,66.83 65.56,66.83 65.88,66.52 69.22,66.52 70.33,67.63 88.74,67.63 v100.33,56.04
E6&E7  (via drill 0.25)
  Top 0.152: J2.E6 9.53,59.37 | 9.53,59.37 J2.E7 | v40.16,20.32 40.16,20.16 40.96,20.16 8BITVD6:R2.1 | v37.31,20.8 36.83,21.27 v36.83,41.27 | v33.72,42.67 33.4,42.67 33.12,42.39 32.07,42.39 30.99,43.47 30.99,45.4 32.07,46.48 32.07,56.83 v31.43,57.47 | 9.53,59.37 v10.32,59.37
  Bottom 0.152: v40.16,20.32 39.69,20.8 v37.31,20.8 | v36.83,41.27 36.83,42.04 36.45,42.42 33.97,42.42 v33.72,42.67 | v31.43,57.47 31.27,57.63 19.21,57.63 19.05,57.78 13.02,57.78 12.86,57.63 12.06,57.63 v10.32,59.37
E9&E3  (via drill 0.25)
  Top 0.152: v8.76,61.98 8.76,61.91 | v10.16,64.29 9.53,64.29 J2.E3 | J2.E9 9.53,56.36 9.21,56.67 9.21,56.99 8.89,57.31 8.89,61.91 8.76,61.91 | v38.42,71.91 40.48,69.85 40.48,67.15 39.85,67.15 8BITVD7:R1.4 | v11.11,71.91 8.54,69.34 8.54,67.6 7.62,66.67 7.62,62.39 8.1,61.91 8.76,61.91
  Bottom 0.152: v8.76,61.98 10.16,63.37 v10.16,64.29 | v38.42,71.91 37.94,72.39 37.47,72.39 37.31,72.23 11.43,72.23 v11.11,71.91
E12&J7  (via drill 0.25)
  Top 0.152: v8.89,54.29 8.89,53.18 9.53,52.55 J2.E12 | v12.54,56.83 13.97,56.83 13.97,58.1 14.61,58.74 J2.J7 14.61,58.9 15.24,59.53 15.24,66.67 16.83,68.26 16.83,71.91 30.48,71.91 34.13,68.26 v36.35,68.26 | v38.73,67.63 38.73,67.79 39.69,67.79 8BITVD7:R1.3
  Bottom 0.152: v8.89,54.29 9.66,55.07 10.78,55.07 v12.54,56.83 | v38.73,67.63 38.1,68.26 v36.35,68.26
E15&J10  (via drill 0.25)
  Top 0.152: v10.16,49.05 10.16,48.74 9.53,48.74 J2.E15 | v33.34,48.9 36.2,51.75 36.2,63.98 38.1,65.88 38.1,67.79 38.89,68.58 39.69,68.58 8BITVD7:R1.2 | v14.13,55.56 14.61,55.09 J2.J10 | v23.97,48.9 v23.97,55.24
  Bottom 0.152: v10.16,49.05 10.32,48.9 17.46,48.9 17.78,49.21 23.97,49.21 | 23.97,49.21 24.77,49.21 25.08,48.9 v33.34,48.9 | v14.13,55.56 14.45,55.24 v23.97,55.24 | 23.97,49.21 v23.97,48.9
E18&F11  (via drill 0.25)
  Top 0.152: v8.89,45.24 8.89,44.93 9.53,44.93 J2.E18 | v2.54,45.09 2.06,45.56 2.06,49.37 1.91,49.53 v1.91,52.7 1.91,66.48 2.41,66.99 5.67,70.25 7.86,70.25 v8.89,71.28 | v10,53.02 10.79,53.82 J2.F11 | v37.62,71.75 39.69,69.69 8BITVD7:R1.1
  Bottom 0.152: v8.89,45.24 8.73,45.09 v2.54,45.09 | v1.91,52.7 2.22,53.02 v10,53.02 | v37.62,71.75 37.47,71.91 11.91,71.91 11.27,71.28 v8.89,71.28
ES6&ES7  (via drill 0.25)
  Top 0.152: 8BITVD6:RN1.9 48.9,17.62 42.86,17.62 8BITVD6:R2.5 42.7,17.46 42.7,9.37 v42.55,9.21
  Bottom 0.152: J1.76 16.35,3.97 16.35,6.03 17.14,6.03 18.1,6.99 29.84,6.99 31.11,8.26 39.53,8.26 40.48,9.21 v42.55,9.21
ES9&ES3  (via drill 0.25)
  Top 0.152: 8BITVD7:RN1.16 56.52,62.39 55.88,63.02 55.88,70.33 47.15,70.33 46.99,70.17 46.99,69.69 41.59,69.69 8BITVD7:R1.8 41.43,69.69 41.43,72.55 37.62,72.55 36.99,71.91 36.99,67.63 35.88,67.63 33.81,65.56 33.81,62.71 32.7,61.59 32.7,48.74 34.29,47.15 34.29,40.8 v34.61,40.48 | J1.77 19.53,9.37 v19.53,13.97 | v27.24,16.19 27.3,16.26 27.3,19.53 26.83,20 26.83,24.45 26.51,24.77 26.51,36.2 v29.37,39.05
  Bottom 0.152: v19.53,13.97 21.75,16.19 v27.24,16.19 | v29.37,39.05 29.53,38.89 33.02,38.89 v34.61,40.48
ES12&JS7  (via drill 0.25)
  Top 0.152: 8BITVD7:R1.7 41.59,68.58 46.99,68.58 46.99,68.42 50.01,65.41 55.24,65.41 8BITVD7:RN1.15 55.24,59.53 v53.18,57.47 | J1.78 13.81,1.11 6.19,1.11 6.19,13.81 5.87,14.13 5.87,14.92 7.62,16.67 v7.62,18.57 | v47.15,24.92 46.35,25.72 46.35,42.86 46.04,43.18 46.04,51.59 v51.91,57.47
  Bottom 0.152: v7.62,18.57 13.65,24.61 26.67,24.61 26.99,24.29 31.11,24.29 31.43,24.61 44.77,24.61 45.09,24.92 v47.15,24.92 | v53.18,57.47 v51.91,57.47
ES15&JS10  (via drill 0.25)
  Top 0.152: 8BITVD7:R1.6 41.59,67.79 47.15,67.79 49.85,65.09 53.98,65.09 8BITVD7:RN1.14 53.98,62.07 52.55,60.64 52.55,41.43 v52.07,40.96 | v30.64,10.32 30.32,10.64 30.32,16.35 32.23,18.26 v32.23,18.89 | v47.15,21.27 49.53,23.65 49.53,28.8 51.12,30.39 51.12,38.73 v50.48,39.37
  Bottom 0.152: J1.79 17.94,10.32 v30.64,10.32 | v32.23,18.89 32.54,18.57 43.34,18.57 46.04,21.27 v47.15,21.27 | v52.07,40.96 v50.48,39.37
ES18&FS11  (via drill 0.25)
  Top 0.152: 8BITVD7:R1.5 41.59,66.99 47.15,66.99 49.37,64.77 52.7,64.77 8BITVD7:RN1.13 52.7,62.07 45.72,55.09 45.72,43.02 46.04,42.7 46.04,27.46 v42.86,27.46 | J1.80 11.27,2.54 11.27,2.06 10.64,1.43 6.51,1.43 6.51,12.22 8.89,14.61 v8.89,24.13 | v40.01,25.56 41.59,27.15 v41.59,27.46
  Bottom 0.152: v8.89,24.13 10.32,25.56 17.46,25.56 17.78,25.24 26.67,25.24 26.99,25.56 v40.01,25.56 | v42.86,27.46 v41.59,27.46
F4  (via drill 0.25)
  Top 0.152: v11.18,63.24 10.79,62.86 J2.F4 | v18.89,63.5 19.53,62.87 19.53,58.58 v19.84,58.26 | v69.22,57.15 69.06,56.99 69.06,46.83 69.85,46.04 69.85,43.34 69.69,43.18 69.69,39.21 69.85,39.05 69.85,35.4 69.06,34.61 69.06,25.24 8BITVD3:R1.1
  Bottom 0.152: v11.18,63.24 11.44,63.5 v18.89,63.5 | v19.84,58.26 20,58.1 68.26,58.1 v69.22,57.15
F7  (via drill 0.25)
  Top 0.152: v12.7,58.26 12.7,58.1 11.43,58.1 10.79,58.74 J2.F7 | v100.33,43.97 101.28,43.02 v101.28,6.35
  Bottom 0.152: v12.7,58.26 13.02,58.58 19.37,58.58 19.68,58.9 20.32,58.9 20.8,58.42 78.58,58.42 80.17,56.83 87.47,56.83 v100.33,43.97 | v101.28,6.35 100.01,5.08 J1.11
F10  (via drill 0.25)
  Top 0.152: v11.43,57.15 11.43,56.04 11.11,55.72 11.11,55.4 10.79,55.09 J2.F10 | v17.14,59.85 18.26,60.96 v18.26,62.23 | v83.34,66.99 93.34,66.99 93.34,68.42 95.09,70.17 96.36,70.17 96.36,69.22 95.73,68.58 8BITVD1:R1.2
  Bottom 0.152: v11.43,57.15 11.43,57.78 10.48,58.74 10.16,58.74 9.68,59.21 9.68,60.01 13.65,60.01 13.81,59.85 v17.14,59.85 | v18.26,62.23 18.89,62.87 21.75,62.87 22.07,63.18 32.23,63.18 32.54,63.5 36.51,63.5 37.94,64.93 48.42,64.93 51.28,62.07 78.42,62.07 v83.34,66.99
F13  (via drill 0.25)
  Top 0.152: v11.43,48.26 11.43,50.48 10.79,51.12 J2.F13 | v46.99,48.26 48.42,46.83 48.42,36.99 49.05,36.35 49.05,34.92 v48.9,34.77
  Bottom 0.152: v11.43,48.26 12.38,47.31 23.88,47.31 24.36,46.82 36.31,46.82 36.32,46.83 41.75,46.83 43.18,48.26 v46.99,48.26 | v48.9,34.77 49.21,35.08 81.12,35.08 86.84,29.37 89.22,29.37 104.78,13.81 104.78,6.03 105.57,5.24 105.57,2.54 J1.6
F16  (via drill 0.25)
  Top 0.152: v11.43,46.67 10.79,47.31 J2.F16 | v43.31,47.62 42.55,46.86 v42.55,46.35 | v73.66,45.4 74.14,44.93 74.14,25.24 v75.25,24.13
  Bottom 0.152: v11.43,46.67 12.06,46.04 42.23,46.04 v42.55,46.35 | v43.31,47.62 43.62,47.31 63.5,47.31 65.41,45.4 v73.66,45.4 | v75.25,24.13 78.42,20.95 87.79,20.95 103.66,5.08 J1.7
F19  (via drill 0.25)
  Top 0.152: v10.16,44.45 10.16,44.29 10.79,43.66 J2.F19 | v1.11,45.88 1.43,45.56 v1.43,23.02 | v45.09,12.22 47.62,9.68 v47.62,9.21
  Bottom 0.152: v10.16,44.45 10.16,45.09 9.37,45.88 v1.11,45.88 | v45.09,12.22 44.45,12.86 36.99,12.86 36.67,12.54 25.56,12.54 25.24,12.86 11.34,12.86 10.76,13.43 9.81,13.43 8.26,14.99 8.26,16.19 v1.43,23.02 | v47.62,9.21 48.1,8.73 61.28,8.73 62.39,7.62 62.39,0.79 102.39,0.79 J1.8
FS4  (via drill 0.25)
  Top 0.152: J1.37 66.04,18.1 66.67,18.73 66.67,20.95 69.06,20.95 70.64,22.54 8BITVD3:R1.5 | 8BITVD3:RN1.13 81.92,6.03 82.39,5.56 82.39,4.45 v82.07,4.13
  Bottom 0.152: v82.07,4.13 81.92,3.97 67.15,3.97 J1.37
FS10
  Top 0.152: 8BITVD1:R1.6 97.47,67.79 108.58,67.79 8BITVD1:RN1.14 108.58,5.71 J1.3
G6  (via drill 0.25)
  Top 0.152: v13.49,68.26 13.49,67.63 12.7,66.83 12.7,60.8 12.06,60.17 J2.G6 | v17.46,70.8 19.84,70.8 20.64,71.6 28.73,71.6 28.73,68.58 32.07,65.25 32.07,57.31 32.38,56.99 32.38,45.97 31.62,45.21 31.62,43.59 v32.07,43.15 | v30.32,39.53 30,39.21 30,5.56 J1.65
  Bottom 0.152: v13.49,68.26 16.03,70.8 v17.46,70.8 | v32.07,43.15 31.3,42.39 31.27,42.39 30.32,41.43 v30.32,39.53
G9  (via drill 0.25)
  Top 0.152: v10.16,55.91 10.16,54.29 10.95,54.29 11.43,54.77 11.43,55.56 12.06,56.2 J2.G9 | v19.21,65.56 19.68,65.56 23.18,69.06 25.08,69.06 25.08,65.88 24.45,65.25 24.45,63.34 27.15,60.64 27.15,53.18 v30.16,50.16 | v76.83,46.2 79.69,43.34 v79.69,40.16 | v95.25,28.57 96.52,27.3 J1.13
  Bottom 0.152: v10.16,55.91 9.55,56.52 3.17,56.52 2.7,56.99 2.7,65.56 v19.21,65.56 | v30.16,50.16 30.48,49.85 73.18,49.85 v76.83,46.2 | v79.69,40.16 83.82,36.04 87.79,36.04 v95.25,28.57
G10&G16  (via drill 0.25)
  Top 0.152: v12.54,46.67 12.54,46.83 12.06,47.31 J2.G16 12.06,47.94 v14.13,47.94 | v12.54,55.56 12.06,55.09 J2.G10 | v38.58,62.71 39.69,62.71 8BITVD7:R2.3 | v37.78,63.5 36.83,62.55 36.83,48.1 v36.2,47.47
  Bottom 0.152: v12.54,46.67 11.59,47.62 9.05,47.62 8.1,48.58 1.27,48.58 0.48,49.37 0.48,53.66 10.64,53.66 v12.54,55.56 | v37.78,63.5 v38.58,62.71 | v14.13,47.94 14.45,47.62 24.38,47.62 24.89,47.12 35.85,47.12 v36.2,47.47
G12  (via drill 0.25)
  Top 0.152: v17.3,54.29 14.29,54.29 13.97,53.98 13.97,53.02 13.02,53.02 12.7,52.7 12.7,52.55 12.06,52.55 J2.G12 | v96.52,36.51 94.61,34.61 94.61,6.03 95.41,5.24 95.41,3.65 J1.14
  Bottom 0.152: v17.3,54.29 17.46,54.45 23.5,54.45 23.65,54.29 29.69,54.29 30.64,53.34 55.4,53.34 56.04,53.98 85.09,53.98 96.52,42.55 v96.52,36.51
G13  (via drill 0.25)
  Top 0.152: v12.7,50.8 12.7,51.12 12.06,51.12 J2.G13 | v21.43,50.48 21.43,44.29 v21.75,43.97 | v49.21,42.7 49.53,42.39 49.53,31.69 47.78,29.94 47.78,24.77 46.83,23.81 v46.67,23.81 | v67.63,20 68.9,20 8BITVD3:R2.1
  Bottom 0.152: v12.7,50.8 13.02,50.48 v21.43,50.48 | v21.75,43.97 22.07,44.29 36.67,44.29 36.83,44.13 49.53,44.13 50.01,43.66 50.01,42.7 v49.21,42.7 | v46.67,23.81 46.74,23.81 47.06,24.14 56.06,24.14 56.39,23.81 63.82,23.81 v67.63,20
G15  (via drill 0.25)
  Top 0.152: v12.7,49.53 12.7,49.37 12.06,48.74 J2.G15 | v1.43,49.21 1.75,48.9 1.75,24.13 v2.38,23.5 | v3.17,22.7 3.49,22.38 3.49,5.71 3.97,5.24 3.97,2.06 5.24,0.79 16.67,0.79 16.67,5.56 v19.53,8.41 | v22.07,7.94 23.5,9.37 v23.5,19.37 | J1.15 v93.98,8.26
  Bottom 0.152: v12.7,49.53 12.38,49.85 7.46,49.85 6.83,50.48 2.7,50.48 v1.43,49.21 | v3.17,22.7 v2.38,23.5 | v19.53,8.41 19.68,8.26 21.75,8.26 v22.07,7.94 | v23.5,19.37 23.81,19.05 27.46,19.05 28.57,17.94 61.91,17.94 66.99,12.86 89.38,12.86 v93.98,8.26
G18  (via drill 0.25)
  Top 0.152: v12.7,44.45 12.7,44.77 12.06,44.77 J2.G18 | v47.82,38.61 48.1,38.32 48.1,36.51 v48.42,36.2 | v93.34,29.69 93.34,6.03 92.87,5.56 92.87,3.65 J1.16
  Bottom 0.152: v12.7,44.45 13.97,43.18 21.27,43.18 21.43,43.02 27.15,43.02 27.78,43.66 36.35,43.66 36.83,43.18 43.24,43.18 v47.82,38.61 | v48.42,36.2 48.9,35.72 87.31,35.72 v93.34,29.69
G21  (via drill 0.25, 0.35)
  Top 0.152: v10,39.05 10.95,39.05 11.43,39.53 11.43,40.32 12.06,40.96 J2.G21 | v3.17,36.2 3.17,24.29 3.81,23.65 3.81,14.35 v4.7,13.46 | v26.35,10.95 27.78,12.38 v27.78,13.18 | v45.09,13.34 47.47,15.72 50.32,15.72 v50.32,15.4 | v89.53,10.64 91.44,8.73 J1.17
  Bottom 0.152: v10,39.05 8.1,39.05 5.24,36.2 v3.17,36.2 | v26.35,10.95 12.7,10.95 10.75,12.91 5.25,12.91 v4.7,13.46 | v27.78,13.18 27.94,13.34 v45.09,13.34 | v50.32,15.4 53.18,12.54 87.63,12.54 v89.53,10.64
G22  (via drill 0.25)
  Top 0.152: v11.43,37.62 11.43,39.05 12.06,39.69 J2.G22 | v81.92,35.08 82.23,35.4 82.23,39.05 82.55,39.37 82.87,39.37 8BITVD2:R2.2
  Bottom 0.152: v11.43,37.62 12.06,36.99 16.03,36.99 16.67,36.35 21.11,36.35 21.27,36.51 47.31,36.51 48.42,35.4 81.6,35.4 v81.92,35.08
G24  (via drill 0.25)
  Top 0.152: v11.43,36.51 12.06,37.15 J2.G24 | v5.24,35.24 5.08,35.08 5.08,31.62 5.29,31.41 5.94,31.41 6.26,31.09 6.26,21.67 5.84,21.25 5.49,21.25 5.17,20.93 5.17,20.91 5.08,20.83 v5.08,20.16 | v89.53,9.84 90.33,9.05 90.33,3.65 J1.18
  Bottom 0.152: v11.43,36.51 10.79,35.88 5.87,35.88 v5.24,35.24 | v89.53,9.84 87.15,12.22 49.53,12.22 47.78,13.97 31.59,13.97 30.48,15.08 26.83,15.08 24.96,13.21 11.53,13.21 10.78,13.95 10.18,13.95 8.89,15.24 8.89,16.35 v5.08,20.16
G25  (via drill 0.25)
  Top 0.152: v12.7,36.35 12.7,36.04 12.06,36.04 J2.G25 | v20.16,35.72 21.43,34.45 v21.43,32.38 | v65.56,31.27 67.63,29.21 67.63,23.81 68.9,22.54 8BITVD3:R1.4
  Bottom 0.152: v12.7,36.35 13.34,35.72 v20.16,35.72 | v21.43,32.38 22.07,31.75 39.05,31.75 39.69,32.38 49.37,32.38 50.48,31.27 v65.56,31.27
G27  (via drill 0.25, 0.35)
  Top 0.152: v10.16,18.8 10.16,28.89 10.95,28.89 11.43,29.37 11.43,32.7 12.06,33.34 J2.G27 | v16.19,12.22 14.61,12.22 10.48,16.34 v10.12,16.34 | v33.02,9.53 v30.96,11.59 | v91.76,9.21 92.55,8.41 92.55,2.06 91.92,1.43 87.79,1.43 87.79,3.49 88.9,4.6 J1.19
  Bottom 0.152: v16.19,12.22 16.83,11.59 v30.96,11.59 | v33.02,9.53 33.34,9.84 58.1,9.84 58.74,9.21 v91.76,9.21 | v10.12,16.34 10.16,16.38 v10.16,18.8
G28  (via drill 0.25)
  Top 0.152: v16.83,31.43 16.83,32.7 13.02,32.7 12.7,32.38 12.7,32.23 12.06,32.23 J2.G28 | v62.07,30.64 63.18,29.53 63.18,17.46 v63.82,16.83 | v67.31,16.67 69.69,16.67 69.69,17.94 69.37,18.26 69.06,18.26 8BITVD3:R2.3
  Bottom 0.152: v16.83,31.43 39.21,31.43 39.85,32.07 49.21,32.07 50.64,30.64 v62.07,30.64 | v63.82,16.83 63.98,16.67 v67.31,16.67
G30  (via drill 0.25)
  Top 0.152: v11.43,26.67 11.43,28.89 12.06,29.53 J2.G30 | v15.08,26.35 15.24,26.19 v15.24,22.86 | v27.94,23.02 28.26,23.34 v28.26,24.92 | v89.22,20.48 88.9,20.16 88.9,6.67 90.01,5.56 90.01,3.65 J1.20
  Bottom 0.152: v11.43,26.67 12.06,26.04 14.76,26.04 v15.08,26.35 | v15.24,22.86 15.4,23.02 v27.94,23.02 | v28.26,24.92 44.61,24.92 45.24,25.56 56.83,25.56 57.63,24.77 84.93,24.77 v89.22,20.48
G31  (via drill 0.25)
  Top 0.152: v15.4,28.89 13.02,28.89 12.7,28.57 12.7,28.42 12.06,28.42 J2.G31 | v31.91,28.73 33.34,30.16 v33.34,32.38 | v62.07,32.7 63.82,30.96 v63.82,17.62 | v67.31,17.46 68.9,17.46 8BITVD3:R2.4
  Bottom 0.152: v15.4,28.89 15.56,28.73 v31.91,28.73 | v33.34,32.38 33.66,32.7 53.5,32.7 53.82,32.38 61.75,32.38 v62.07,32.7 | v63.82,17.62 63.98,17.46 v67.31,17.46
G33  (via drill 0.25)
  Top 0.152: v12.7,26.67 12.7,26.51 12.06,25.88 J2.G33 | v87.95,28.73 88.58,28.1 88.58,6.51 v88.27,6.19
  Bottom 0.152: v12.7,26.67 13.34,27.3 22.7,27.3 23.18,27.78 40.64,27.78 41.59,28.73 v87.95,28.73 | v88.27,6.19 87.15,5.08 J1.21
G34  (via drill 0.25)
  Top 0.152: v12.7,24.92 12.7,24.61 12.06,24.61 J2.G34 | v27.15,24.92 27.3,24.77 27.3,20 v27.94,19.37 | v67.47,18.26 68.26,19.05 68.9,19.05 8BITVD3:R2.2
  Bottom 0.152: v27.15,24.92 v12.7,24.92 | v27.94,19.37 29.05,18.26 v67.47,18.26
G36  (via drill 0.25)
  Top 0.152: v12.57,22.7 12.06,22.19 J2.G36 | v87.95,17.62 87.63,17.3 87.63,3.81 J1.22
  Bottom 0.152: v12.57,22.7 13.21,23.34 14.92,23.34 15.24,23.65 31.11,23.65 31.43,23.34 44.29,23.34 45.4,24.45 46.94,24.45 46.95,24.44 56.46,24.44 56.77,24.13 74.45,24.13 77.95,20.64 84.93,20.64 v87.95,17.62
G37  (via drill 0.25)
  Top 0.152: v12.7,21.43 12.06,20.8 J2.G37 | v22.7,22.38 23.02,22.7 v23.02,26.83 | v46.99,28.1 46.67,28.42 46.67,47.78 46.35,48.1 46.35,50.64 v51.91,56.2 | v53.18,56.2 57.78,60.8 63.18,60.8 63.18,65.88 v65.25,67.94 | v66.04,67.15 67.63,67.15 8BITVD4:R1.4
  Bottom 0.152: v12.7,21.43 13.37,22.1 17.81,22.1 18.1,22.38 v22.7,22.38 | v23.02,26.83 23.65,27.46 40.8,27.46 41.43,28.1 v46.99,28.1 | v53.18,56.2 v51.91,56.2 | v66.04,67.15 v65.25,67.94
GND  (via drill 0.25, 0.35)
  Top 0.152: J1.66 31.59,3.65 v31.59,6.03 31.59,6.95 v31.62,6.99
  Bottom 0.152: v55.88,6.35 J1.45 | J1.66 31.27,3.33 32.23,3.33 32.54,3.65 38.58,3.65 39.69,2.54 J1.58
  other vias: 84.33,27.43 89.28,31.11 90.3,43.18 83.31,49.66 79.12,59.05 78.74,50.16 78.23,46.74 75.69,49.02 74.17,46.86 71.25,48.26 70.99,50.8 67.94,59.18 66.67,42.42 71.88,43.18 54.48,27.81 62.23,26.54 66.29,26.54 66.17,29.72 68.45,32.13 72.52,32.26 67.44,33.66 55.12,33.02 56.9,33.02 56.52,20.95 62.48,14.48 56.13,14.1 49.91,13.84 45.59,15.37 43.43,15.62 51.94,27.69 48.64,27.81 50.16,27.81 52.7,23.37 51.44,23.5 57.78,23.11 34.54,48.77 34.67,55.5 38.99,55.37 38.86,48.13 37.97,42.42 40.01,41.53 41.15,39.75 42.8,40.26 43.18,49.02 92.33,65.79 87.88,63.88 78.61,66.67 72.9,66.67 73.28,70.87 88.9,70.61 72.39,69.09 89.66,26.42 78.23,32.64 79.63,37.34 74.93,32.89 76.45,42.55 76.07,38.99 61.72,48.39 61.72,50.93 59.94,56.01 63.88,57.4 50.55,50.8 51.18,48.51 48.39,55.75 50.04,57.4 59.44,65.15 44.32,65.79 63.25,68.96 59.94,68.71 64.01,64.77 66.04,64.64 65.53,59.05 70.1,65.53 81.41,60.71 92.2,56.52 89.53,57.53 93.73,52.96 91.82,50.55 90.55,49.4 95.76,55.5 100.58,52.2 101.35,59.18 104.65,57.91 109.35,57.28 96.01,34.04 93.6,33.27 95.5,15.11 95.38,10.92 91.31,14.1 92.58,18.41 77.47,14.61 76.71,10.16 82.8,10.79 84.71,11.18 85.22,14.86 73.79,15.49 71.25,10.67 68.58,10.67 72.39,21.21 72.14,26.42 67.69,15.49 64.52,7.87 49.4,8 46.74,8 30.86,9.14 31.37,10.29 32.89,11.43 28.57,10.92 36.32,20.7 44.07,20.95 46.23,20.07 47.12,12.7 43.43,12.19 38.35,12.19 36.96,15.75 40.26,15.24 31.75,20.95 35.43,24 27.56,9.53 13.97,15.11 5.33,9.4 7.49,10.79 10.54,10.67 13.34,11.94 19.56,16.13 1.52,10.79 4.06,70.36 27.56,8 24.13,7.87 24.13,9.53 22.61,9.53 14.99,9.27 49.28,30.23 47.62,31.11 47.37,34.16 41.27,31.24 44.58,30.73 41.27,34.54 40.13,29.08 35.43,28.83 40.13,12.19 38.35,15.75 32,16.64 31.88,14.73 29.34,16.51 28.07,16.76 26.16,15.49 84.96,33.91 82.04,32.13 4.83,15.49 7.62,21.34 5.08,22.61 7.62,26.42 5.08,37.85 2.54,33.15 2.67,37.85 7.62,36.58 7.62,40.26 12.7,37.72 11.43,34.04 8.89,34.04 16.76,42.29 10.16,42.8 3.94,46.74 1.02,47.12 6.35,46.74 3.94,51.82 7.62,51.82 3.81,54.36 7.62,59.44 10.16,60.58 13.97,64.39 16.89,64.26 13.97,62.1 11.43,64.39 19.3,66.29 17.27,66.17 18.54,69.6 13.72,70.74 11.81,69.34 12.45,67.69 7.62,67.56 17.02,57.15 1.04,55.78 1.27,50.16 1.14,52.2 13.97,22.73 11.43,20.07 9.53,15.75 11.81,13.84 80.64,22.48 78.61,22.23 83.19,22.23 85.72,22.23 60.07,45.85 64.14,42.67 65.41,42.67 69.09,43.18 70.48,43.81 67.82,40.89 94.11,42.8 95.89,41.02 54.61,67.69 34.92,43.05 32.89,43.05 111.63,66.93 105.92,66.17 99.69,69.09 4.95,64.52 3.3,62.61 6.1,69.34 28.7,48.13 27.56,50.29 24.26,41.4 20.95,41.53 20.95,39.62 22.99,39.62 22.73,32.38 27.69,32.38 25.65,56.01 28.7,55.75 34.54,60.45 41.27,55.75 48.26,48.13 47.5,41.53 63.12,34.42 60.33,41.91 71.63,57.4 81.15,10.79 84.84,8.64 98.68,13.72 77.34,7.75
  pour Top: 0,6.35 114.3,6.35 114.3,73.03 0,73.03
  pour Bottom: 0,6.35 114.3,6.35 114.3,73.03 0,73.03
GS10&GS16  (via drill 0.25)
  Top 0.152: 8BITVD7:RN1.11 50.16,63.66 41.59,63.66 8BITVD7:R2.7 41.43,63.5 40.8,64.14 40.8,64.93 v40.16,65.56 | J1.82 9.05,3.65 9.05,5.56 15.08,11.59 16.26,11.59 16.83,12.16 v16.83,20 | v39.21,66.2 36.51,63.5 36.51,51.59 35.56,50.64 35.56,37.31 35.72,37.15 35.72,30.86 33.75,28.89 33.75,23.21 v35.78,21.18
  Bottom 0.152: v16.83,20 33.18,20 33.34,19.84 34.45,19.84 v35.78,21.18 | v39.21,66.2 39.85,65.56 v40.16,65.56
GS13
  Top 0.152: 8BITVD3:RN1.9 76.83,17.62 70.8,17.62 8BITVD3:R2.5 70.64,17.46 70.64,17.14 67.47,13.97 67.47,3.97 63.02,3.97 62.39,4.6 62.39,5.08 J1.41
GS22  (via drill 0.25)
  Top 0.152: 8BITVD2:R2.6 84.77,38.73 88.9,38.73 88.9,39.05 89.06,39.21 90.81,39.21 8BITVD2:RN1.10 90.81,37.94 87.31,34.45 87.31,9.68 85.25,7.62 85.25,1.43 v82.55,1.43
  Bottom 0.152: J1.32 74.77,1.43 v82.55,1.43
GS25  (via drill 0.25)
  Top 0.152: 73.5,25.24 70.8,25.24 8BITVD3:R1.8 | v73.5,26.35 73.5,25.24 | v81.92,26.35 85.09,26.35 85.09,18.57 85.72,17.94 8BITVD3:RN1.16 | J1.34 72.23,3.65 72.23,15.88 v72.71,16.35 | v74.77,21.59 73.82,22.54 73.82,24.92 73.5,25.24
  Bottom 0.152: v81.92,26.35 v73.5,26.35 | v72.71,16.35 72.71,16.67 74.77,18.73 v74.77,21.59
GS28  (via drill 0.25)
  Top 0.152: 8BITVD3:RN1.11 79.38,19.53 78.58,19.53 78.26,19.21 70.8,19.21 8BITVD3:R2.7 70.64,19.05 70.64,18.89 v69.85,18.89 | J1.39 65.41,6.99 65.41,18.73 v65.72,19.05
  Bottom 0.152: v65.72,19.05 65.88,18.89 v69.85,18.89
GS31  (via drill 0.25)
  Top 0.152: v66.67,8.26 66.67,18.26 66.99,18.57 66.99,20.64 69.69,20.64 70.17,20.16 70.64,20.16 8BITVD3:R2.8 | v74.61,3.33 74.61,3.65 78.9,3.65 79.85,4.6 79.85,5.24 80.33,5.71 80.33,17.46 80.64,17.78 8BITVD3:RN1.12
  Bottom 0.152: v66.67,8.26 64.61,6.19 64.61,3.65 | 64.61,3.65 64.61,2.54 J1.38 | v74.61,3.33 74.3,3.65 64.61,3.65
GS34
  Top 0.152: 8BITVD3:R2.6 70.8,18.41 76.2,18.41 76.2,18.73 76.36,18.89 78.11,18.89 8BITVD3:RN1.10 78.11,17.62 72.55,12.06 72.55,1.11 64.93,1.11 J1.40
GS37  (via drill 0.25)
  Top 0.152: 8BITVD4:R1.8 69.53,69.69 74.93,69.69 74.93,70.17 75.09,70.33 81.28,70.33 81.28,67.79 84.45,64.61 8BITVD4:RN1.16 84.45,62.07 v81.12,58.74 | J1.42 62.39,2.54 62.39,3.02 63.02,3.65 67.47,3.65 67.47,2.06 68.1,1.43 70.01,1.43 70.01,14.45 v71.91,16.35 | v74.14,20.16 75.88,21.91 75.88,35.4 80.33,39.85 80.33,44.45 79.85,44.93 v79.85,57.94
  Bottom 0.152: v71.91,16.35 74.14,18.57 v74.14,20.16 | v79.85,57.94 80.64,58.74 v81.12,58.74
H7  (via drill 0.25)
  Top 0.152: v15.56,69.53 15.56,70.17 9.84,70.17 8.89,69.22 8.89,63.63 9.34,63.18 9.84,63.18 10.16,62.87 10.16,61.91 11.11,61.91 11.43,61.59 11.43,59.37 12.38,59.37 12.7,59.05 12.7,58.9 13.34,58.9 J2.H7 | v42.07,70.33 46.67,70.33 46.99,70.64 62.07,70.64 v62.07,66.2 | v65.72,65.88 67.63,65.88 67.63,64.61 8BITVD4:R2.1
  Bottom 0.152: v15.56,69.53 16.03,69.06 16.51,69.06 17.3,68.26 21.75,68.26 22.86,69.37 24.29,69.37 25.4,68.26 30.96,68.26 32.07,69.37 33.5,69.37 34.61,68.26 35.56,68.26 37.62,70.33 v42.07,70.33 | v62.07,66.2 62.39,65.88 v65.72,65.88
H8  (via drill 0.25)
  Top 0.152: v13.97,59.21 13.97,58.58 13.65,58.26 13.65,57.94 13.34,57.63 J2.H8 | v20.8,44.61 v20.8,59.21 | v51.28,44.45 51.44,44.29 51.44,40.01 52.07,39.37 v52.07,38.89 | v53.98,38.73 54.93,38.73 8BITVD5:R2.3
  Bottom 0.152: v20.8,59.21 v13.97,59.21 | v20.8,44.61 21.11,44.93 43.18,44.93 43.34,44.77 50.96,44.77 v51.28,44.45 | v52.07,38.89 52.23,38.73 v53.98,38.73
H10  (via drill 0.25)
  Top 0.152: v12.7,54.61 12.7,54.93 13.34,54.93 J2.H10 | v23.65,55.88 23.34,55.56 23.34,44.45 v26.19,41.59 | v29.05,39.69 29.69,39.69 30.16,40.16 30.96,40.16 30.96,23.53 31.42,23.07 32.59,23.07 35.34,20.32 35.34,17.21 v35.88,16.67 | v48.1,14.45 48.26,14.29 J1.51
  Bottom 0.152: v12.7,54.61 12.7,54.93 14.29,56.52 23.02,56.52 v23.65,55.88 | v26.19,41.59 28.1,39.69 v29.05,39.69 | v35.88,16.67 35.88,15.91 37.34,14.45 v48.1,14.45
H11&H17  (via drill 0.25)
  Top 0.152: v13.97,44.45 13.97,45.4 13.34,46.04 J2.H17 | v27.94,43.02 31.43,46.51 31.43,53.34 | v31.43,55.24 31.43,53.34 | v37.47,56.2 37.47,62.39 38.58,63.5 39.69,63.5 8BITVD7:R2.2 | v11.59,53.02 12.22,53.02 12.7,53.5 12.7,53.66 13.34,53.66 J2.H11 | 31.43,53.34 v27.78,53.34
  Bottom 0.152: v13.97,44.45 13.34,45.09 12.54,45.09 12.06,44.61 12.06,44.13 12.22,44.13 12.86,43.5 13.18,43.5 13.81,42.86 21.11,42.86 21.27,42.7 27.62,42.7 v27.94,43.02 | v31.43,55.24 32.38,56.2 v37.47,56.2 | v11.59,53.02 11.91,52.7 16.35,52.7 16.67,52.39 16.99,52.39 18.41,53.82 23.18,53.82 23.65,53.34 v27.78,53.34
H13  (via drill 0.25)
  Top 0.152: v13.97,51.59 13.97,51.28 13.34,51.28 J2.H13 | v20.16,44.93 v20.16,51.59 | v53.5,44.29 54.93,42.86 8BITVD5:R1.4
  Bottom 0.152: v13.97,51.59 14.13,51.44 20,51.44 v20.16,51.59 | v20.16,44.93 20.48,45.24 43.34,45.24 43.5,45.09 52.7,45.09 v53.5,44.29
H14  (via drill 0.25)
  Top 0.152: v13.97,49.53 13.97,49.85 13.34,49.85 J2.H14 | v25.24,49.53 25.88,48.9 25.88,43.02 26.99,41.91 4BITVD1:R1.2
  Bottom 0.152: v25.24,49.53 v13.97,49.53
H16  (via drill 0.25)